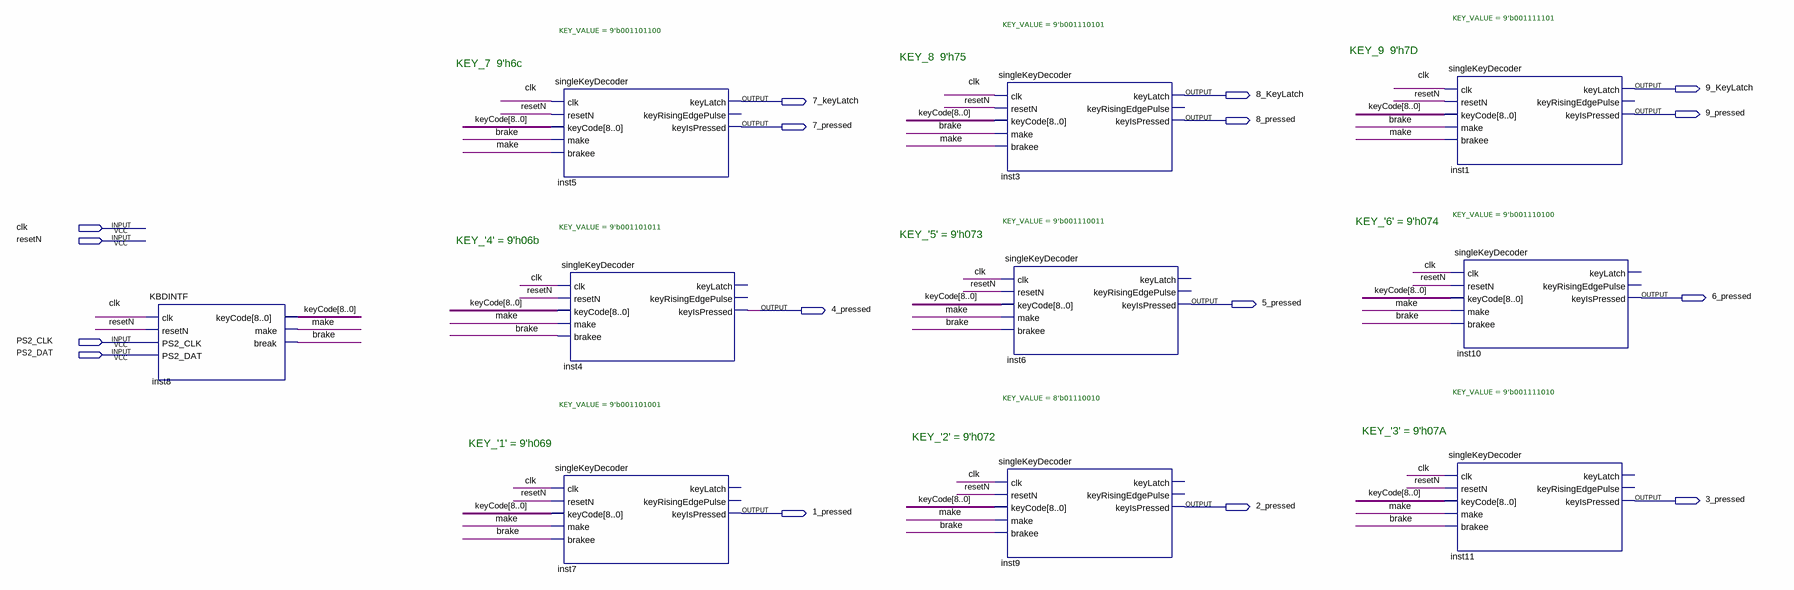
[diagram p0: schematic sheet]
// Quartus schematic OURKBD.bdf as structural Verilog: 10 symbols, 16 pins
module OURKBD (
  input  clk,
  input  resetN,
  input  PS2_CLK,
  input  PS2_DAT,
  output \9_KeyLatch ,
  output \8_KeyLatch ,
  output \7_keyLatch ,
  output \9_pressed ,
  output \8_pressed ,
  output \7_pressed ,
  output \6_pressed ,
  output \5_pressed ,
  output \4_pressed ,
  output \3_pressed ,
  output \2_pressed ,
  output \1_pressed 
);

  wire brake, make;
  wire [8:0] keyCode;

  KBDINTF inst8 (
    .clk(clk), .resetN(resetN), .PS2_CLK(PS2_CLK), .PS2_DAT(PS2_DAT), .keyCode(keyCode), .make(make),
    .\break (brake));
  singleKeyDecoder #(.KEY_VALUE(9'b001101100)) inst5 (
    .clk(clk), .resetN(resetN), .keyCode(keyCode), .make(brake), .brakee(make), .keyLatch(\7_keyLatch ),
    .keyIsPressed(\7_pressed ));  // open: keyRisingEdgePulse
  singleKeyDecoder #(.KEY_VALUE(9'b001101011)) inst4 (
    .clk(clk), .resetN(resetN), .keyCode(keyCode), .make(make), .brakee(brake), .keyIsPressed(\4_pressed ));  // open: keyLatch, keyRisingEdgePulse
  singleKeyDecoder #(.KEY_VALUE(9'b001101001)) inst7 (
    .clk(clk), .resetN(resetN), .keyCode(keyCode), .make(make), .brakee(brake), .keyIsPressed(\1_pressed ));  // open: keyLatch, keyRisingEdgePulse
  singleKeyDecoder #(.KEY_VALUE(9'b001110101)) inst3 (
    .clk(clk), .resetN(resetN), .keyCode(keyCode), .make(brake), .brakee(make), .keyLatch(\8_KeyLatch ),
    .keyIsPressed(\8_pressed ));  // open: keyRisingEdgePulse
  singleKeyDecoder #(.KEY_VALUE(9'b001110011)) inst6 (
    .clk(clk), .resetN(resetN), .keyCode(keyCode), .make(make), .brakee(brake), .keyIsPressed(\5_pressed ));  // open: keyLatch, keyRisingEdgePulse
  singleKeyDecoder #(.KEY_VALUE(8'b01110010)) inst9 (
    .clk(clk), .resetN(resetN), .keyCode(keyCode), .make(make), .brakee(brake), .keyIsPressed(\2_pressed ));  // open: keyLatch, keyRisingEdgePulse
  singleKeyDecoder #(.KEY_VALUE(9'b001111101)) inst1 (
    .clk(clk), .resetN(resetN), .keyCode(keyCode), .make(brake), .brakee(make), .keyLatch(\9_KeyLatch ),
    .keyIsPressed(\9_pressed ));  // open: keyRisingEdgePulse
  singleKeyDecoder #(.KEY_VALUE(9'b001110100)) inst10 (
    .clk(clk), .resetN(resetN), .keyCode(keyCode), .make(make), .brakee(brake), .keyIsPressed(\6_pressed ));  // open: keyLatch, keyRisingEdgePulse
  singleKeyDecoder #(.KEY_VALUE(9'b001111010)) inst11 (
    .clk(clk), .resetN(resetN), .keyCode(keyCode), .make(make), .brakee(brake), .keyIsPressed(\3_pressed ));  // open: keyLatch, keyRisingEdgePulse

  // Notes on the sheet:
  //   KEY_9  9'h7D
  //   KEY_8  9'h75
  //   KEY_7  9'h6c
  //   KEY_'6' = 9'h074
  //   KEY_'5' = 9'h073
  //   KEY_'4' = 9'h06b
  //   KEY_'3' = 9'h07A
  //   KEY_'2' = 9'h072
  //   KEY_'1' = 9'h069
endmodule
